# Altium schematic sheet Isolated-5V-5V.SchDoc
size A; SheetNumber: 6; SheetTotal: 8
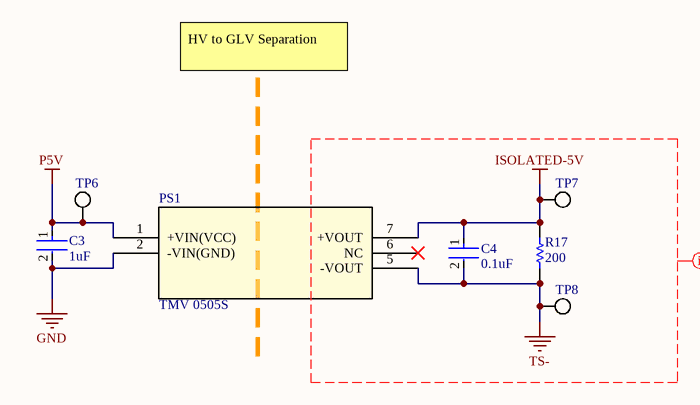
[diagram p0: Isolated-5V-5V.SchDoc]

## Parts
C3  1uF  [FP-C3216-160-0_2-IPC_B]
C4  0.1uF  [FP-C1206C-EB-MFG]
PS1  TMV 0505S  [TMV05-SINGLE_TRP]
R17  200  [RESC3216X70X50LL05T20]
TP6  (no value)  [FOOTPRINT-GENERIC-TP-VIA-1MM]
TP7  (no value)  [FOOTPRINT-GENERIC-TP-VIA-1MM]
TP8  (no value)  [FOOTPRINT-GENERIC-TP-VIA-1MM]

## Nets
GND: C3.2 PS1.2(-VIN(GND))
ISOLATED-5V: C4.1 PS1.7(+VOUT) R17.2 TP7.1(TP)
P5V: C3.1 PS1.1(+VIN(VCC)) TP6.1(TP)
TS-: C4.2 PS1.5(-VOUT) R17.1 TP8.1(TP)

Not connected (* = marked no-connect by the designer): PS1 6(NC)*

## Layout directives
net class HV: ISOLATED-5V, TS-

## Notes on the sheet
- HV to GLV Separation

## Library data of the parts
C3 = CMP-2000-05402-2: Multilayer Ceramic Capacitors 1uF ±10% 50V X7R SMD 1206; Voltage: 25V; Voltage Rating (DC): 50V; Dielectric: X7R; Number of Pins: 2; Length: 0.126inch; Case Code (Imperial): 1206; Capacitance: 1uF; Package Quantity: 2000; Min Operating Temperature: -55°C; Lead Free: Lead Free; Radiation Hardening: No; Termination: SMD/SMT; Case Code (Metric): 3216; Series: C; Weight: 0.000571oz; REACH SVHC: No SVHC; Tolerance: 10%; Max Operating Temperature: 125°C; RoHS Compliant: Yes; Mount: Surface Mount; Dielectric Material: Ceramic; Packaging: Tape and Reel; Thickness: 0.071inch; Height: 1.6mm; Resistor Type: Ceramic; Width: 0.063inch; Voltage Rating: 50V; Depth: 1.6mm; Case/Package: 1206
C4 = CMP-1037-04229-2: CAP CER 0.1UF 250V X7R 1206; Manufacturer Part Number: C1206C104KARACTU; Manufacturer: KEMET; Material: Ceramic; Temperature Coefficient: 15%; Value: 0.10 μF; Tolerance: 0.1; Automotive Grade: Grade 0; Mouser Description: Multilayer Ceramic Capacitors MLCC - SMD/SMT 250volts 0.1uF X7R 10%; Height: 0.88mm; Device Class L3: Ceramic Capacitors; Temperature Range Low: -55°C; Automotive: Yes; ComponentLink2Description: Datasheet; Category: Cap; RoHS: TRUE; Temperature Range High: +150°C; Package: C1206C-EB; Device Class L2: Capacitors; Voltage Rating: 250 V; Lead Free: Yes; Temperature Characteristic: X7R; Digikey Description: CAP CER 0.1UF 250V X7R 1206; ComponentLink2URL: https://content.kemet.com/datasheets/KEM_C1007_X8R_ULTRA_150C_SMD.pdf; Device Class L1: Passive Components; Ipc Land Pattern Name: CAPC320160X78; Temperature: -55°C to +150°C; Capacitance: 0.10 μF; Octopart: https://octopart.com/c1206c104karactu-kemet-193627
PS1 = CMP-053-000000-4: No Description Available; Vendor: Traco Power; SourceLibrary: Traco_Power_2020-05-29; Built_By: EMA_Justin; Copyright: Copyright (C) 2018 Accelerated Designs. All rights reserved; Source: 2021-05-26_16-57-50.SchLib; Datasheet: https://www.mouser.com/datasheet/2/687/tmv-519347.pdf; Design Item ID: TMV 0505S; Type: DEV; RefDes: RefDes; Manufacturer_Part_Number: TMV 0505S
R17 = CMP-2003-00194-1: Fixed Resistor, Metal Glaze/thick Film, 0.25W, 200ohm, 200V, 1% +/-Tol, 100ppm/Cel, Surface Mount, 1206; Part Number: ERJ-8ENF2000V; Manufacturer: Panasonic
TP6-TP8 = CMP-025-000000-1: Source: Generic.SchLib; Design Item ID: Misc-Generic-TP